# EAGLE design sch_0034_121_pcb1_graphdone (EAGLE 6.2)
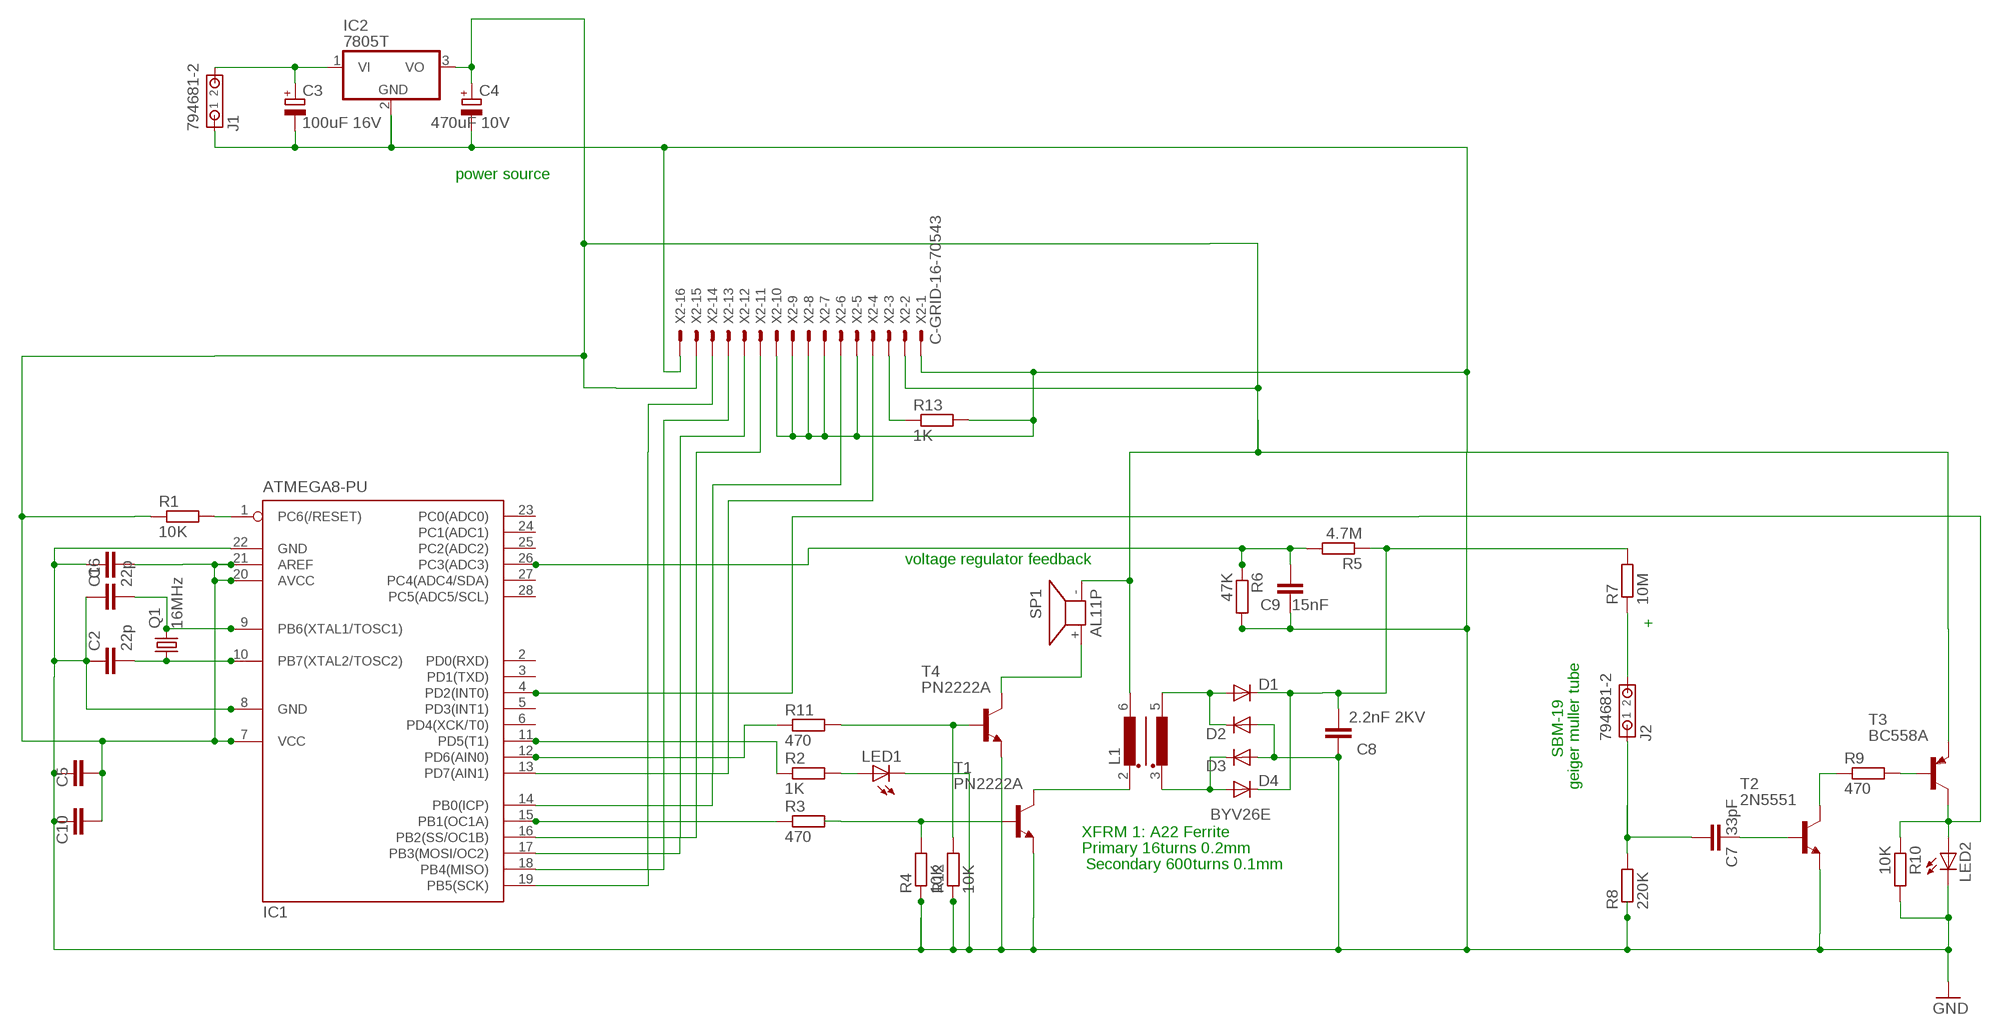
[diagram p0: schematic, sheet 1]

## Parts
C1  22p  C-EU025-024X044  [C025-024X044]
C2  22p  C-EU025-024X044  [C025-024X044]
C3  100uF 16V  CPOL-EUE2,5-6E  [E2,5-6E]
C4  470uF 10V  CPOL-EUE2,5-6E  [E2,5-6E]
C5  100nF  C-EU025-024X044  [C025-024X044]
C6  100nF  C-EU025-024X044  [C025-024X044]
C7  33pF  C-EU025-024X044  [C025-024X044]
C8  2.2nF 2KV  C-EU025-024X044  [C025-024X044]
C9  15nF  C-EU025-024X044  [C025-024X044]
C10  100nF  C-EU025-024X044  [C025-024X044]
D1  DIODE-D-7.5  [D-7.5]
D2  DIODE-D-7.5  [D-7.5]
D3  DIODE-D-7.5  [D-7.5]
D4  BYV26E  DIODE-D-7.5  [D-7.5]
IC1  ATMEGA8-PU  MEGA8-P  [DIL28-3]
IC2  7805T  [TO220H]
J1  794681-2  [794681-2]
J2  794681-2  [794681-2]
L1  RM6-2  [RM5-4]
LED1  LED3MM  [LED3MM]
LED2  LED3MM  [LED3MM]
Q1  16MHz  CRYSTALHC49U-V  [HC49U-V]
R1  10K  R-EU_0204/7  [0204/7]
R2  1K  R-EU_0204/7  [0204/7]
R3  470  R-EU_0204/7  [0204/7]
R4  10K  R-EU_0204/7  [0204/7]
R5  4.7M  R-EU_0204/7  [0204/7]
R6  47K  R-EU_0204/7  [0204/7]
R7  10M  R-EU_0204/7  [0204/7]
R8  220K  R-EU_0204/7  [0204/7]
R9  470  R-EU_0204/7  [0204/7]
R10  10K  R-EU_0204/7  [0204/7]
R11  470  R-EU_0204/7  [0204/7]
R12  10K  R-EU_0204/7  [0204/7]
R13  1K  R-EU_0204/7  [0204/7]
SP1  AL11P  [AL11P]
T1  PN2222A  -NPN-TO92-EBC  [TO92-EBC]
T2  2N5551  -NPN-TO92-EBC  [TO92-EBC]
T3  BC558A  [TO92-EBC]
T4  PN2222A  -NPN-TO92-EBC  [TO92-EBC]
X2  C-GRID-16-70543  [70543-16]

## Nets
GND: C1.1 C2.1 C3.- C4.- C5.2 C6.2 C8.1 C9.1 C10.2 D2.A D3.A IC1.8(GND) IC1.22(GND) IC2.2(GND) J1.1 LED1.K(C) LED2.K(C) R4.1 R6.2 R8.1 R10.2 R12.1 R13.2 T1.E T2.E T4.E X2.1 X2.5 X2.7 X2.8 X2.9 X2.10 X2.16
N$1: C1.2 IC1.9(PB6(XTAL1/TOSC1)) Q1.2
N$2: C2.2 IC1.10(PB7(XTAL2/TOSC2)) Q1.1
N$4: IC1.18(PB4(MISO)) X2.13
N$5: IC1.11(PD5(T1)) R2.1
N$6: R3.2 R4.2 T1.B
N$7: SP1.+ T4.C
N$9: C4.+ C5.1 C6.1 C10.1 IC1.7(VCC) IC1.20(AVCC) IC1.21(AREF) IC2.3(VO) L1.6(W1E) R1.1 SP1.- T3.E X2.2 X2.15
N$11: IC1.12(PD6(AIN0)) R11.1
N$12: R11.2 R12.2 T4.B
N$14: LED1.A R2.2
N$27: C3.+ IC2.1(VI) J1.2
N$29: L1.2(W1A) T1.C
N$30: C7.2 J2.1 R8.2
N$32: D3.C D4.A L1.3(W2A)
N$33: D1.A D2.C L1.5(W2E)
N$34: C7.1 T2.B
N$35: C8.2 D1.C D4.C R5.1 R7.2
N$37: C9.2 IC1.26(PC3(ADC3)) R5.2 R6.1
N$39: J2.2 R7.1
N$40: R9.1 T2.C
N$41: R9.2 T3.B
N$42: IC1.4(PD2(INT0)) LED2.A R10.1 T3.C
N$51: IC1.13(PD7(AIN1)) X2.4
N$53: IC1.1(PC6(/RESET)) R1.2
N$55: IC1.15(PB1(OC1A)) R3.1
N$56: IC1.19(PB5(SCK)) X2.14
N$57: IC1.17(PB3(MOSI/OC2)) X2.12
N$59: R13.1 X2.3
N$60: IC1.14(PB0(ICP)) X2.6
N$61: IC1.16(PB2(SS/OC1B)) X2.11
Unconnected: IC1.2(PD0(RXD)) IC1.3(PD1(TXD)) IC1.5(PD3(INT1)) IC1.6(PD4(XCK/T0)) IC1.23(PC0(ADC0)) IC1.24(PC1(ADC1)) IC1.25(PC2(ADC2)) IC1.27(PC4(ADC4/SDA)) IC1.28(PC5(ADC5/SCL))

## Notes on the sheet
- power source
- voltage regulator feedback
- +
- SBM-19
- geiger muller tube
- XFRM 1: A22 Ferrite
- Primary 16turns 0.2mm
- Secondary 600turns 0.1mm

## Library data of the parts
C1 C2 C5-C10 = resistor:C-EU: CAPACITOR, European symbol
C3 C4 = resistor:CPOL-EU: POLARIZED CAPACITOR, European symbol
D1-D4 = diode:DIODE-: DIODE
IC1 = atmel:MEGA8-P: MICROCONTROLLER 8 Kbytes FLASH, 1 kbytes SRAM, 512 bytes EEPROM, USART, 4-channel 10 bit ADC, 2-channel 8 bit ADC Pin compatible with Atmega48, ATMega88, ATMega168 Source: avr.lbr; OC_FARNELL: unknown; OC_NEWARK: unknown
IC2 = linear:78*: Positive VOLTAGE REGULATOR Source: http://cache.national.com/ds/LM/LM78L05.pdf http://www.fairchildsemi.com/ds/LM/LM7805.pdf
J1 J2 = con-amp:794681-2: Micro MATE-N-LOK Connectors grid 1.5mm Dual Row Through Hole Vertical Metal Through Hole Holddowns Source: ENG_CD_794681_E.pdf
L1 = trafo-siemens:RM6-2: TRANSFORMER; OC_FARNELL: unknown; OC_NEWARK: unknown
LED1 LED2 = led:LED: LED OSRAM: - CHIPLED LG R971, LG N971, LY N971, LG Q971, LY Q971, LO R971, LY R971 LH N974, LH R974 LS Q976, LO Q976, LY Q976 LO Q996 - Hyper CHIPLED LW Q18S LB Q993, LB Q99A, LB R99A - SideLED LS A670, LO A670, LY A670, LG A670, LP A670 LB A673, LV A673, LT A673, LW A673 LH A674 LY A675 LS A676, LA A676, LO A676, LY A676, LW A676 LS A679, LY A679, LG A679 - Hyper Micro SIDELED® LS Y876, LA Y876, LO Y876, LY Y876 LT Y87S - SmartLED LW L88C, LW L88S LB L89C, LB L89S, LG L890 LS L89K, LO L89K, LY L89K LS L896, LA L896, LO L896, LY L896 - TOPLED LS T670, LO T670, LY T670, LG T670, LP T670 LSG T670, LSP T670, LSY T670, LOP T670, LYG T670 LG T671, LOG T671, LSG T671 LB T673, LV T673, LT T673, LW T673 LH T674 LS T676, LA T676, LO T676, LY T676, LB T676, LH T676, LSB T676, LW T676 LB T67C, LV T67C, LT T67C, LS T67K, LO T67K, LY T67K, LW E67C LS E67B, LA E67B, LO E67B, LY E67B, LB E67C, LV E67C, LT E67C LW T67C LS T679, LY T679, LG T679 LS T770, LO T770, LY T770, LG T770, LP T770 LB T773, LV T773, LT T773, LW T773 LH T774 LS E675, LA E675, LY E675, LS T675 LS T776, LA T776, LO T776, LY T776, LB T776 LHGB T686 LT T68C, LB T68C - Hyper Mini TOPLED® LB M676 - Mini TOPLED Santana® LG M470 LS M47K, LO M47K, LY M47K Source: http://www.osram.convergy.de LUXEON: - LUMILED® LXK2-PW12-R00, LXK2-PW12-S00, LXK2-PW14-U00, LXK2-PW14-V00 LXK2-PM12-R00, LXK2-PM12-S00, LXK2-PM14-U00 LXK2-PE12-Q00, LXK2-PE12-R00, LXK2-PE12-S00, LXK2-PE14-T00, LXK2-PE14-U00 LXK2-PB12-K00, LXK2-PB12-L00, LXK2-PB12-M00, LXK2-PB14-N00, LXK2-PB14-P00, LXK2-PB14-Q00 LXK2-PR12-L00, LXK2-PR12-M00, LXK2-PR14-Q00, LXK2-PR14-R00 LXK2-PD12-Q00, LXK2-PD12-R00, LXK2-PD12-S00 LXK2-PH12-R00, LXK2-PH12-S00 LXK2-PL12-P00, LXK2-PL12-Q00, LXK2-PL12-R00 Source: www.luxeon.com KINGBRIGHT: KA-3528ASYC Source: www.kingbright.com
Q1 = crystal:CRYSTAL: CRYSTAL; OC_FARNELL: 1666969; OC_NEWARK: unknown
R1-R13 = rcl:R-EU_: RESISTOR, European symbol
SP1 = buzzer:AL11P: SPEAKER Source: Buerklin; OC_FARNELL: unknown; OC_NEWARK: unknown
T1 T2 T4 = transistor:*-NPN-: NPN Transistror BF959 corrected 2008.03.06
T3 = transistor-pnp:BC558*: PNP Transistror
X2 = con-molex:C-GRID-16: CONNECTOR wire to board 2.54 mm (0.100") pitch header; OC_FARNELL: unknown; OC_NEWARK: unknown

## Board
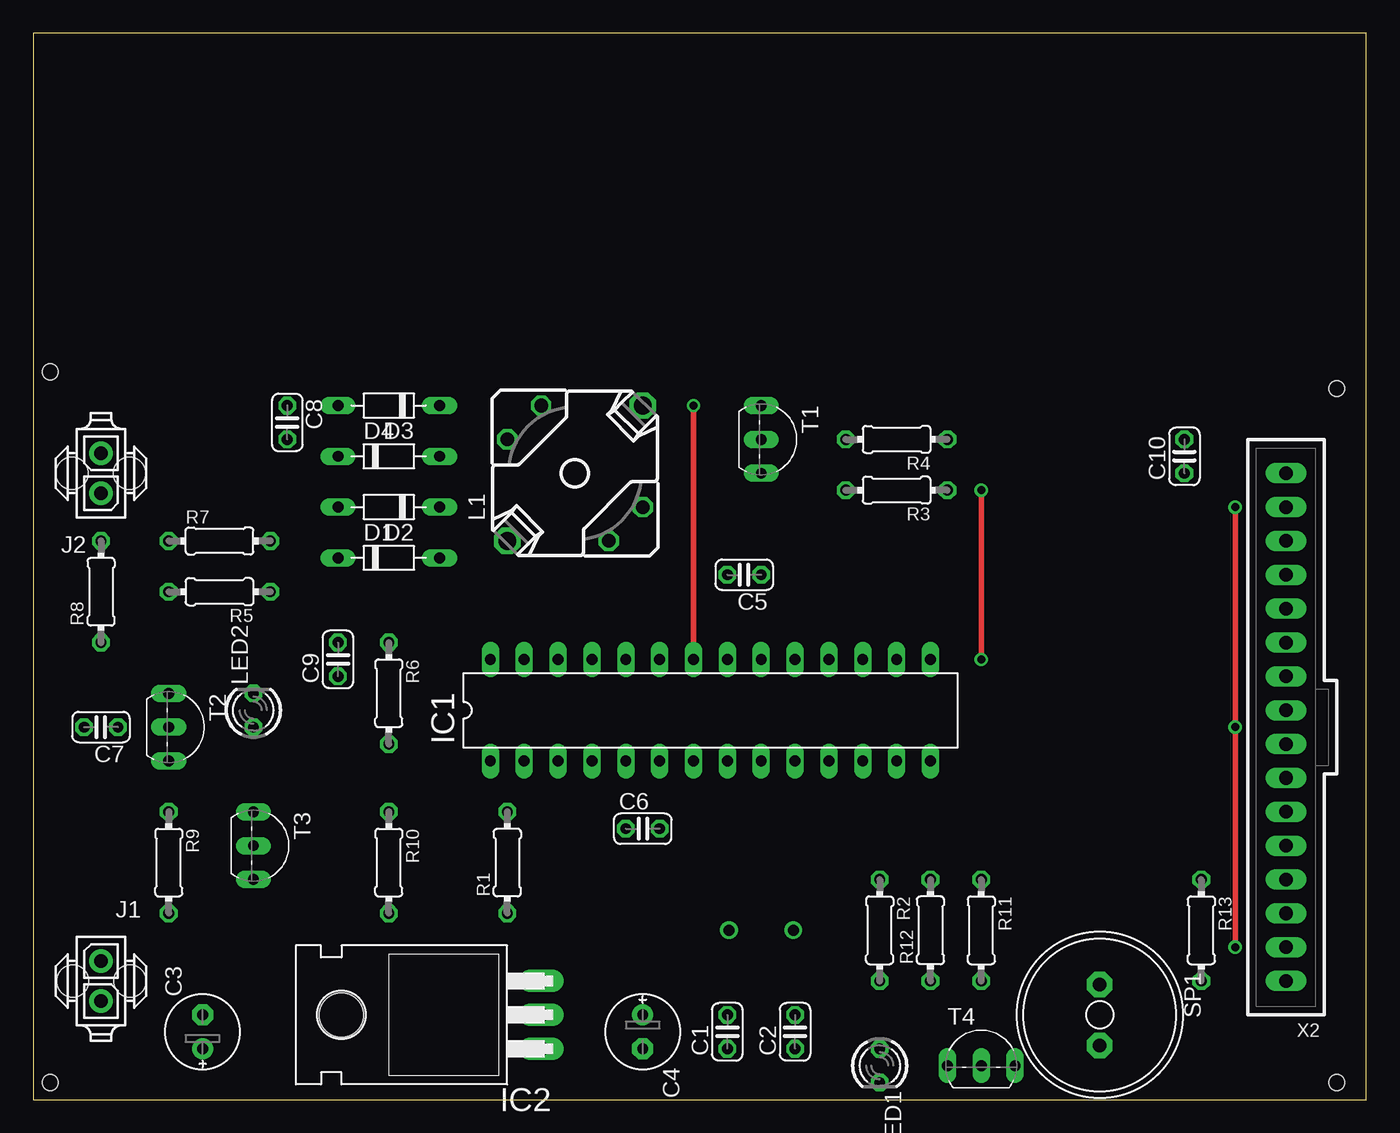
[diagram p1: board, top side]
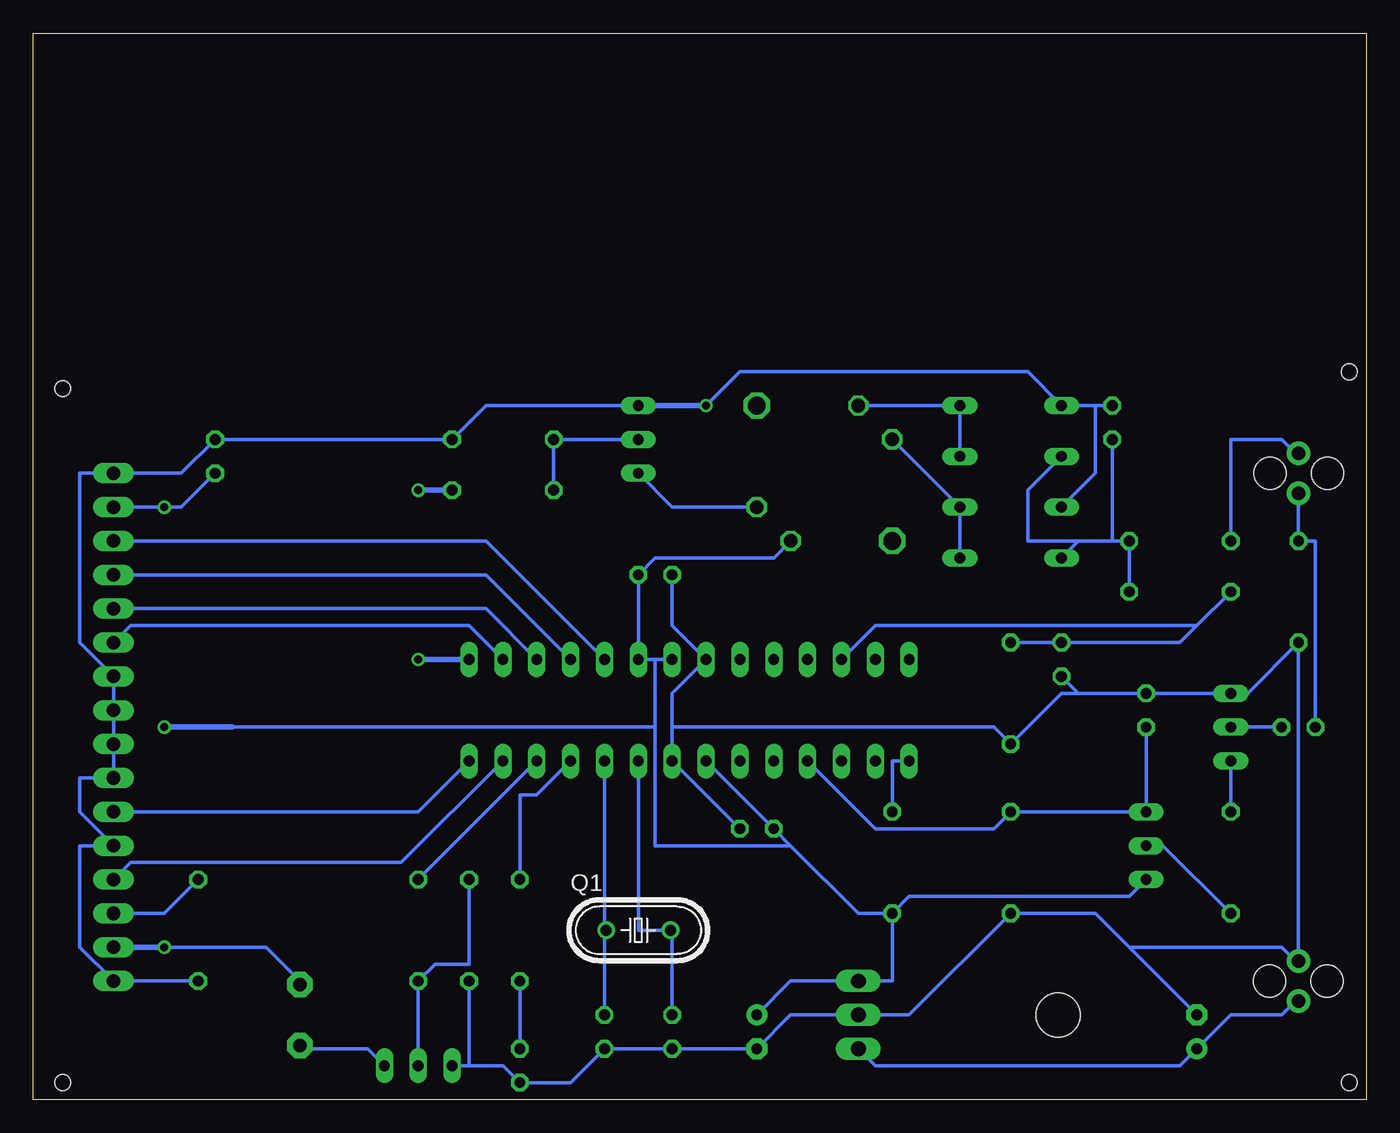
[diagram p2: board, bottom side, seen from below]

Size 100 x 80 mm. Coordinates in mm from the lower left corner, seen from the top.
Outline: 0,0 100,0 100,80 0,80 0,0
Copper layers (1*16): Top 0.035mm / dielectric 1.5mm / Bottom 0.035mm
Design rules: minimum track width 10mil, minimum drill 24mil, track to track 8mil, track to pad 8mil, pad to pad 8mil, via to via 8mil, smd to smd 8mil, copper to edge 40mil, drill to drill 8mil, minimum pad ring 10mil, minimum via ring 8mil, stop-mask expansion 4mil, vias tented up to drill 0mil, thermal gap 10mil
Holes 1.2 mm at 1.27,1.27 1.27,54.61 97.79,1.27 97.79,53.34

### Footprints (pad centres in the part's own frame; a part is rotated, then mirrored left to right if it is on the bottom)
C025-024X044 = drill 0.813 octagon: 1 -1.27,0; 2 1.27,0
E2,5-6E = drill 0.813 pad 1.575: + -1.27,0 | drill 0.813 pad 1.575 octagon: - 1.27,0
D-7.5 = drill 0.813 long: A 3.81,0; C -3.81,0
DIL28-3 = drill 0.813 long: 1 -16.51,-3.81; 2 -13.97,-3.81; 3 -11.43,-3.81; 4 -8.89,-3.81; 5 -6.35,-3.81; 6 -3.81,-3.81; 7 -1.27,-3.81; 8 1.27,-3.81; 9 3.81,-3.81; 10 6.35,-3.81; 11 8.89,-3.81; 12 11.43,-3.81; 13 13.97,-3.81; 14 16.51,-3.81; 15 16.51,3.81; 16 13.97,3.81; 17 11.43,3.81; 18 8.89,3.81; 19 6.35,3.81; 20 3.81,3.81; 21 1.27,3.81; 22 -1.27,3.81; 23 -3.81,3.81; 24 -6.35,3.81; 25 -8.89,3.81; 26 -11.43,3.81; 27 -13.97,3.81; 28 -16.51,3.81
TO220H = drill 1.118 long: 1 -2.54,-10.16; 2 0,-10.16; 3 2.54,-10.16 | hole 3.302: 0,4.826
794681-2 = drill 1 pad 1.778: 1 0,-1.5; 2 0,1.5 | hole 2.4: 2.13,0; -2.17,0
RM5-4 = drill 1.016 octagon: 2 5.08,-2.54; 3 -2.54,5.08; 5 -5.08,2.54; 6 2.54,-5.08 | drill 1.321 octagon: M -5.08,-5.08; M1 5.08,5.08
LED3MM = drill 0.813 octagon: A -1.27,0; K 1.27,0
HC49U-V = drill 0.813: 1 -2.413,0; 2 2.413,0
0204/7 = drill 0.813 octagon: 1 -3.81,0; 2 3.81,0
AL11P = drill 1.016 pad 1.905 octagon: + 2.286,0; - -2.286,0
TO92-EBC = drill 0.813 long: B 0,-1.27; C 2.54,-1.27; E -2.54,-1.27
TO92-EBC' = drill 0.813 long: B 0,-1.27; C -2.54,-1.27; E 2.54,-1.27
70543-16 = drill 1.016 long: 1 -19.05,0; 2 -16.51,0; 3 -13.97,0; 4 -11.43,0; 5 -8.89,0; 6 -6.35,0; 7 -3.81,0; 8 -1.27,0; 9 1.27,0; 10 3.81,0; 11 6.35,0; 12 8.89,0; 13 11.43,0; 14 13.97,0; 15 16.51,0; 16 19.05,0

### Placement (x,y rotation side)
C1  52.07,5.08 90 top
C2  57.15,5.08 90 top
C3  12.7,5.08 90 top
C4  45.72,5.08 270 top
C5  53.34,39.37 180 top
C6  45.72,20.32 0 top
C7  5.08,27.94 180 top
C8  19.05,50.8 270 top
C9  22.86,33.02 90 top
C10  86.36,48.26 90 top
D1  26.67,40.64 0 top
D2  26.67,44.45 180 top
D3  26.67,52.07 180 top
D4  26.67,48.26 0 top
IC1  50.8,29.21 0 top
IC2  27.94,6.35 90 top
J1  5.08,8.89 180 top
J2  5.08,46.99 0 top
L1  40.64,46.99 0 top
LED1  63.5,2.54 270 top
LED2  16.51,29.21 90 top
Q1  54.61,12.7 0 bottom
R1  35.56,17.78 90 top
R2  63.5,12.7 270 top
R3  64.77,45.72 180 top
R4  64.77,49.53 180 top
R5  13.97,38.1 180 top
R6  26.67,30.48 270 top
R7  13.97,41.91 0 top
R8  5.08,38.1 90 top
R9  10.16,17.78 270 top
R10  26.67,17.78 270 top
R11  71.12,12.7 270 top
R12  67.31,12.7 90 top
R13  87.63,12.7 270 top
SP1  80.01,6.35 270 top
T1  55.88,49.53 270 top
T2  11.43,27.94 270 top
T3  BC558A  [TO92-EBC']  17.78,19.05 270 top
T4  71.12,3.81 0 top
X2  93.98,27.94 90 top

### Tracks (layer width: path | path; a pad name or v marks a point on that pad's centre or on a via)
GND  (via drill 0.6)
  Top 0.406: IC1.22 49.53,49.53 v49.53,52.07
  Bottom 0.254: T4.E 67.31,2.54 | 67.31,2.54 64.77,2.54 LED1.K 59.69,1.27 C2.1 C1.1 C4.- 43.18,6.35 IC2.2 34.29,6.35 R10.2 20.32,13.97 17.78,11.43 | 67.31,2.54 R12.1 | 17.78,11.43 C3.- | 5.08,10.16 6.35,11.43 17.78,11.43 | 5.08,10.16 J1.1 | R13.2 X2.1 96.52,11.43 96.52,19.05 X2.5 96.52,21.59 96.52,24.13 X2.7 X2.8 X2.9 X2.10 96.52,34.29 96.52,46.99 X2.16 88.9,46.99 C10.2 R4.1 66.04,52.07 T1.E | 21.59,30.48 C9.1 | 21.59,30.48 LED2.K T2.E 8.89,30.48 R8.1 J1.1 | 21.59,30.48 22.86,30.48 R6.2 27.94,27.94 52.07,27.94 | D2.A 20.32,46.99 20.32,52.07 | C8.1 20.32,52.07 | 20.32,52.07 D3.A 25.4,54.61 46.99,54.61 v49.53,52.07 | C6.2 IC1.8 52.07,27.94 | C5.2 52.07,35.56 IC1.22 52.07,30.48 52.07,27.94 | J1.1 5.08,10.16 | 5.08,10.16 J1.1
  Bottom 0.406: T1.E v49.53,52.07
N$1
  Bottom 0.254: 52.07,12.7 C1.2 | 52.07,12.7 Q1.2 | IC1.9 54.61,12.7 Q1.2 | 52.07,12.7 Q1.2 | 52.07,12.7 Q1.2
N$2
  Bottom 0.254: 57.15,12.7 C2.2 | 57.15,12.7 Q1.1 57.15,12.7 | 57.15,12.7 IC1.10
N$4
  Bottom 0.254: IC1.18 66.04,39.37 X2.13
N$5
  Bottom 0.254: R2.1 63.5,22.86 62.23,22.86 IC1.11
N$6
  Bottom 0.254: T1.B R4.2 R3.2
N$7
  Bottom 0.254: T4.C 74.93,3.81 80.01,3.81 SP1.+
N$9  (via drill 0.6)
  Top 0.406: v90.17,11.43 90.17,12.7 v90.17,27.94 90.17,40.64 v90.17,44.45
  Bottom 0.254: C10.1 88.9,44.45 v90.17,44.45 X2.15 | v90.17,11.43 82.55,11.43 80.01,8.89 SP1.- | 53.34,33.02 IC1.20 C5.1 53.34,40.64 44.45,40.64 L1.6 | 53.34,33.02 IC1.21 | IC1.7 C6.1 43.18,19.05 | R1.1 35.56,8.89 IC2.3 43.18,8.89 C4.+ | T3.E 17.78,15.24 34.29,15.24 R1.1 | 43.18,19.05 38.1,13.97 R1.1 | 53.34,27.94 53.34,19.05 43.18,19.05 | 53.34,27.94 53.34,33.02 | 53.34,27.94 85.09,27.94
  Bottom 0.406: X2.2 v90.17,11.43 | 85.09,27.94 v90.17,27.94
N$11
  Bottom 0.254: R11.1 IC1.12
N$12
  Bottom 0.254: T4.B R11.2 69.85,10.16 67.31,10.16 R12.2
N$14
  Bottom 0.254: R2.2 LED1.A
N$27
  Bottom 0.254: J1.2 5.08,7.62 6.35,6.35 10.16,6.35 C3.+ 13.97,2.54 36.83,2.54 IC2.1
N$29
  Bottom 0.254: T1.C 52.07,44.45 L1.2
N$30
  Bottom 0.254: C7.2 3.81,41.91 R8.2 J2.1 | J2.1 5.08,45.72 J2.1
N$32
  Bottom 0.254: D4.A D3.C L1.3
N$33
  Bottom 0.254: D1.A D2.C L1.5
N$34
  Bottom 0.254: T2.B C7.1
N$35
  Bottom 0.254: R5.1 R7.2 19.05,41.91 | 19.05,41.91 C8.2 | 21.59,41.91 D1.C | 19.05,41.91 21.59,41.91 | D4.C 25.4,45.72 25.4,41.91 21.59,41.91
N$37
  Bottom 0.254: 12.7,35.56 13.97,34.29 C9.2 R6.1 | 12.7,35.56 R5.2 | IC1.26 36.83,35.56 12.7,35.56
N$39
  Bottom 0.254: R7.1 10.16,49.53 6.35,49.53 5.08,48.26 J2.2
N$40
  Bottom 0.254: T2.C R9.1
N$41
  Bottom 0.254: R9.2 15.24,19.05 T3.B
N$42
  Bottom 0.254: LED2.A T3.C R10.1 27.94,20.32 36.83,20.32 IC1.4
N$51
  Bottom 0.254: IC1.13 72.39,17.78 92.71,17.78 X2.4
N$53
  Bottom 0.254: R1.2 35.56,25.4 IC1.1
N$55  (via drill 0.6)
  Top 0.406: v71.12,45.72 v71.12,33.02
  Bottom 0.406: IC1.15 v71.12,33.02 | R3.1 v71.12,45.72
N$56
  Bottom 0.254: IC1.19 66.04,41.91 X2.14
N$57
  Bottom 0.254: IC1.17 66.04,36.83 X2.12
N$59
  Bottom 0.254: R13.1 90.17,13.97 X2.3
N$60
  Bottom 0.254: IC1.14 71.12,21.59 X2.6
N$61
  Bottom 0.254: IC1.16 67.31,35.56 92.71,35.56 X2.11